# Altium schematic sheet laser_show_peripheral.SchDoc
size A4
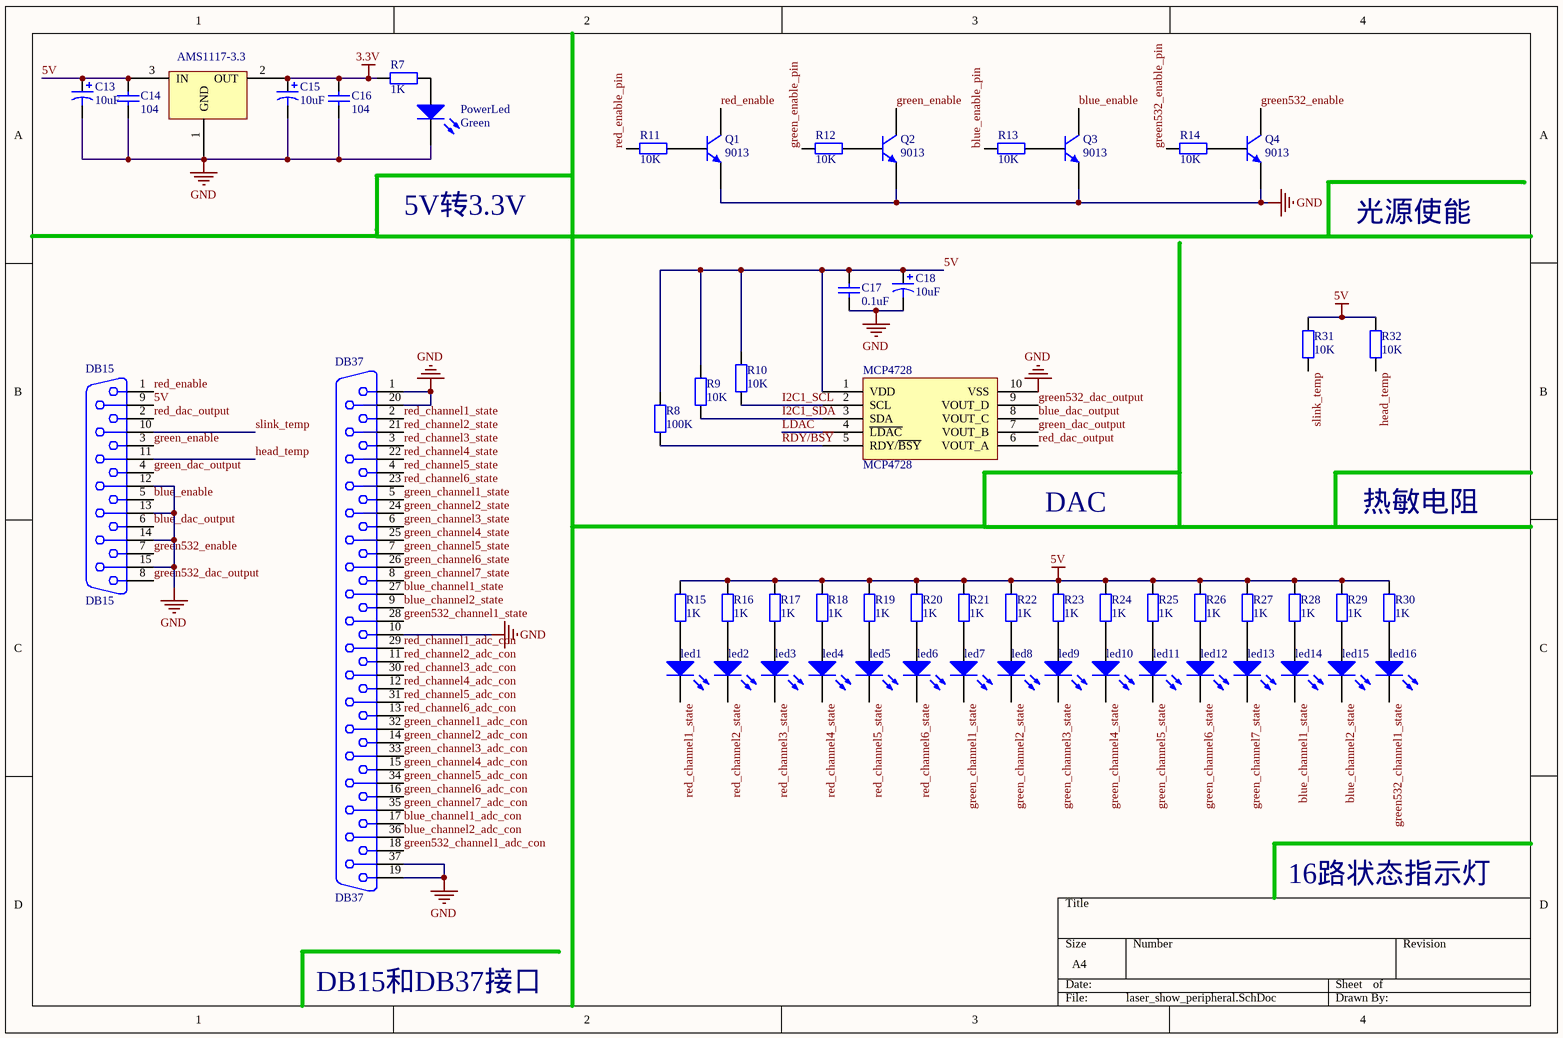
[diagram p0: laser_show_peripheral.SchDoc]

## Parts
AMS1117-3.3  ASM1117  [ASM1117]  (value not drawn)
C13  10uF  [0805CAP_POL]
C14  104  [0805C]
C15  10uF  [0805CAP_POL]
C16  104  [0805C]
C17  0.1uF  [0603C]
C18  10uF  [0805CAP_POL]
DB15  DB15  [DB15/M]
DB37  DB37  [DB37/M]
led1  red  [0805-LED]  (value not drawn)
led2  red  [0805-LED]  (value not drawn)
led3  red  [0805-LED]  (value not drawn)
led4  red  [0805-LED]  (value not drawn)
led5  red  [0805-LED]  (value not drawn)
led6  red  [0805-LED]  (value not drawn)
led7  red  [0805-LED]  (value not drawn)
led8  red  [0805-LED]  (value not drawn)
led9  red  [0805-LED]  (value not drawn)
led10  red  [0805-LED]  (value not drawn)
led11  red  [0805-LED]  (value not drawn)
led12  red  [0805-LED]  (value not drawn)
led13  red  [0805-LED]  (value not drawn)
led14  red  [0805-LED]  (value not drawn)
led15  red  [0805-LED]  (value not drawn)
led16  red  [0805-LED]  (value not drawn)
MCP4728  MCP4728  [MSOP10]
PowerLed  Green  [0805-LED]
Q1  9013  [SOT23_L]
Q2  9013  [SOT23_L]
Q3  9013  [SOT23_L]
Q4  9013  [SOT23_L]
R7  1K  [0805R]
R8  100K  [0603R]
R9  10K  [0603R]
R10  10K  [0603R]
R11  10K  [0805R]
R12  10K  [0805R]
R13  10K  [0805R]
R14  10K  [0805R]
R15  1K  [0805R]
R16  1K  [0805R]
R17  1K  [0805R]
R18  1K  [0805R]
R19  1K  [0805R]
R20  1K  [0805R]
R21  1K  [0805R]
R22  1K  [0805R]
R23  1K  [0805R]
R24  1K  [0805R]
R25  1K  [0805R]
R26  1K  [0805R]
R27  1K  [0805R]
R28  1K  [0805R]
R29  1K  [0805R]
R30  1K  [0805R]
R31  10K  [0805R]
R32  10K  [0805R]

## Nets
3.3V: AMS1117-3.3.2(OUT) C15.1 C16.2 R7.1
5V: AMS1117-3.3.3(IN) C13.1 C14.2 C17.2 C18.1 DB15.9 MCP4728.1(VDD) R8.2 R9.2 R10.2 R15.2 R16.2 R17.2 R18.2 R19.2 R20.2 R21.2 R22.2 R23.2 R24.2 R25.2 R26.2 R27.2 R28.2 R29.2 R30.2 R31.2 R32.2
GND: AMS1117-3.3.1(GND) C13.2 C14.1 C15.2 C16.1 C17.1 C18.2 DB15.12 DB15.13 DB15.14 DB15.15 DB37.1 DB37.10 DB37.19 DB37.20 DB37.37 MCP4728.10(VSS) PowerLed.2(K) Q1.1(E) Q2.1(E) Q3.1(E) Q4.1(E)
blue_channel1_adc_con: DB37.17
blue_channel1_state: DB37.27 led14.2(K)
blue_channel2_adc_con: DB37.36
blue_channel2_state: DB37.9 led15.2(K)
blue_dac_output: DB15.6 MCP4728.8(VOUT_C)
blue_enable: DB15.5 Q3.3(C)
blue_enable_pin: R13.2
green532_channel1_adc_con: DB37.18
green532_channel1_state: DB37.28 led16.2(K)
green532_dac_output: DB15.8 MCP4728.9(VOUT_D)
green532_enable: DB15.7 Q4.3(C)
green532_enable_pin: R14.2
green_channel1_adc_con: DB37.32
green_channel1_state: DB37.5 led7.2(K)
green_channel2_adc_con: DB37.14
green_channel2_state: DB37.24 led8.2(K)
green_channel3_adc_con: DB37.33
green_channel3_state: DB37.6 led9.2(K)
green_channel4_adc_con: DB37.15
green_channel4_state: DB37.25 led10.2(K)
green_channel5_adc_con: DB37.34
green_channel5_state: DB37.7 led11.2(K)
green_channel6_adc_con: DB37.16
green_channel6_state: DB37.26 led12.2(K)
green_channel7_adc_con: DB37.35
green_channel7_state: DB37.8 led13.2(K)
green_dac_output: DB15.4 MCP4728.7(VOUT_B)
green_enable: DB15.3 Q2.3(C)
green_enable_pin: R12.2
head_temp: DB15.11 R32.1
I2C1_SCL: MCP4728.2(SCL) R10.1
I2C1_SDA: MCP4728.3(SDA) R9.1
~{LDA}C: MCP4728.4(~{LDAC})
RDY/~{BSY}: MCP4728.5(RDY/~{BSY}) R8.1
red_channel1_adc_con: DB37.29
red_channel1_state: DB37.2 led1.2(K)
red_channel2_adc_con: DB37.11
red_channel2_state: DB37.21 led2.2(K)
red_channel3_adc_con: DB37.30
red_channel3_state: DB37.3 led3.2(K)
red_channel4_adc_con: DB37.12
red_channel4_state: DB37.22 led4.2(K)
red_channel5_adc_con: DB37.31
red_channel5_state: DB37.4 led5.2(K)
red_channel6_adc_con: DB37.13
red_channel6_state: DB37.23 led6.2(K)
red_dac_output: DB15.2 MCP4728.6(VOUT_A)
red_enable: DB15.1 Q1.3(C)
red_enable_pin: R11.2
slink_temp: DB15.10 R31.1
Netled1_1: led1.1(A) R15.1
Netled2_1: led2.1(A) R16.1
Netled3_1: led3.1(A) R17.1
Netled4_1: led4.1(A) R18.1
Netled5_1: led5.1(A) R19.1
Netled6_1: led6.1(A) R20.1
Netled7_1: led7.1(A) R21.1
Netled8_1: led8.1(A) R22.1
Netled9_1: led9.1(A) R23.1
Netled10_1: led10.1(A) R24.1
Netled11_1: led11.1(A) R25.1
Netled12_1: led12.1(A) R26.1
Netled13_1: led13.1(A) R27.1
Netled14_1: led14.1(A) R28.1
Netled15_1: led15.1(A) R29.1
Netled16_1: led16.1(A) R30.1
NetPowerLed_1: PowerLed.1(A) R7.2
NetQ1_2: Q1.2(B) R11.1
NetQ2_2: Q2.2(B) R12.1
NetQ3_2: Q3.2(B) R13.1
NetQ4_2: Q4.2(B) R14.1

## Notes on the sheet
- 5V转3.3V
- 光源使能
- DAC
- 热敏电阻
- 16路状态指示灯
- DB15和DB37接口

## Library data of the parts
C13 C15 C18 = CAP_Polar: Cap polar
C14 C16 C17 = CAP: capacitance
led1-led16 PowerLed = LED
Q1-Q4 = 2N3904: NPN General Purpose Amplifier; Published: 8-Jun-2000; LatestRevisionDate: 15-Jan-2003; LatestRevisionNote: PCB Footprint 'BCY-W3/D4.7' replaced; DatasheetVersion: 1997; PackageVersion: Sep-1998; PackageReference: TO-92A; Publisher: Altium Limited; PackageDescription: TO, Flat Index; 3 In-Line, Axial Leads; Body Dia. 4.5mm; Leads 0.51 x 0.48 mm (max); ComponentLink1Description: Manufacturer Link; ComponentLink1URL: http://www.fairchildsemi.com/; ComponentLink2Description: Datasheet; ComponentLink2URL: http://www.fairchildsemi.com/ds/2N%2F2N3904.pdf
R7-R32 = RES: resistor